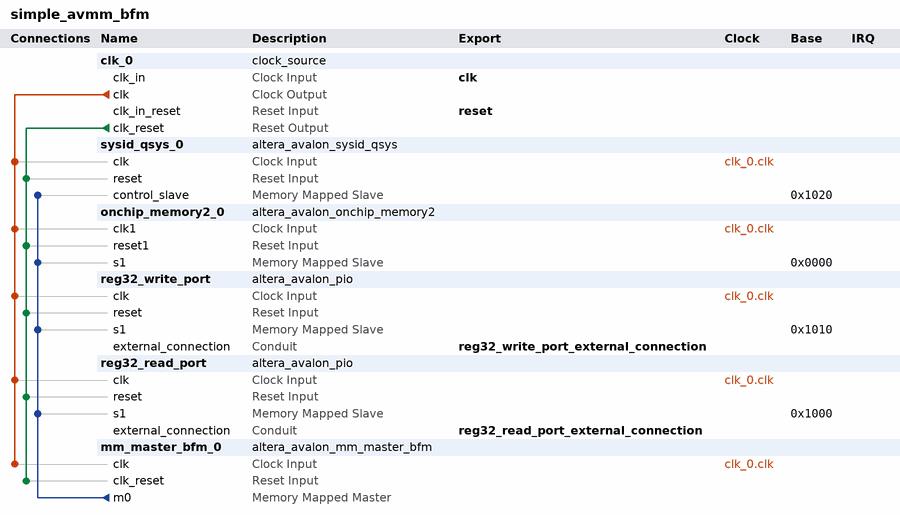
[diagram p0: system contents]
# Platform Designer (Qsys) system simple_avmm_bfm, MAX 10 10M02DCV36I7G
# Parameters at their usual value, and those the tool derives, are not listed.
package require -exact qsys 16.1
create_system simple_avmm_bfm
set_project_property DEVICE_FAMILY {MAX 10}
set_project_property DEVICE 10M02DCV36I7G

add_instance clk_0 clock_source 16.1
set_instance_parameter_value clk_0 clockFrequency 50000000

add_instance sysid_qsys_0 altera_avalon_sysid_qsys 16.1
set_instance_parameter_value sysid_qsys_0 id 538510345

add_instance onchip_memory2_0 altera_avalon_onchip_memory2 16.1
set_instance_parameter_value onchip_memory2_0 dataWidth 32
set_instance_parameter_value onchip_memory2_0 dualPort false
set_instance_parameter_value onchip_memory2_0 initMemContent true
set_instance_parameter_value onchip_memory2_0 initializationFileName onchip_mem.hex
set_instance_parameter_value onchip_memory2_0 memorySize 4096

add_instance reg32_write_port altera_avalon_pio 16.1
set_instance_parameter_value reg32_write_port direction Output
set_instance_parameter_value reg32_write_port width 32

add_instance reg32_read_port altera_avalon_pio 16.1
set_instance_parameter_value reg32_read_port direction Input
set_instance_parameter_value reg32_read_port width 32

add_instance mm_master_bfm_0 altera_avalon_mm_master_bfm 16.1
set_instance_parameter_value mm_master_bfm_0 ADDRESS_UNITS SYMBOLS
set_instance_parameter_value mm_master_bfm_0 AV_ADDRESS_W 32
set_instance_parameter_value mm_master_bfm_0 AV_ALWAYS_BURST_MAX_BURST 0
set_instance_parameter_value mm_master_bfm_0 AV_BURSTCOUNT_W 3
set_instance_parameter_value mm_master_bfm_0 AV_BURST_BNDR_ONLY 1
set_instance_parameter_value mm_master_bfm_0 AV_BURST_LINEWRAP 1
set_instance_parameter_value mm_master_bfm_0 AV_CONSTANT_BURST_BEHAVIOR 1
set_instance_parameter_value mm_master_bfm_0 AV_FIX_READ_LATENCY 1
set_instance_parameter_value mm_master_bfm_0 AV_MAX_PENDING_WRITES 0
set_instance_parameter_value mm_master_bfm_0 AV_NUMSYMBOLS 4
set_instance_parameter_value mm_master_bfm_0 AV_READRESPONSE_W 8
set_instance_parameter_value mm_master_bfm_0 AV_READ_WAIT_TIME 1
set_instance_parameter_value mm_master_bfm_0 AV_WRITERESPONSE_W 8
set_instance_parameter_value mm_master_bfm_0 USE_BURSTCOUNT 1
set_instance_parameter_value mm_master_bfm_0 USE_BYTE_ENABLE 1
set_instance_parameter_value mm_master_bfm_0 USE_READ 1
set_instance_parameter_value mm_master_bfm_0 USE_READ_DATA 1
set_instance_parameter_value mm_master_bfm_0 USE_READ_DATA_VALID 1
set_instance_parameter_value mm_master_bfm_0 USE_WAIT_REQUEST 1
set_instance_parameter_value mm_master_bfm_0 VHDL_ID 0

# connections
add_connection clk_0.clk mm_master_bfm_0.clk clock
add_connection clk_0.clk onchip_memory2_0.clk1 clock
add_connection clk_0.clk reg32_read_port.clk clock
add_connection clk_0.clk reg32_write_port.clk clock
add_connection clk_0.clk sysid_qsys_0.clk clock
add_connection clk_0.clk_reset mm_master_bfm_0.clk_reset reset
add_connection clk_0.clk_reset onchip_memory2_0.reset1 reset
add_connection clk_0.clk_reset reg32_read_port.reset reset
add_connection clk_0.clk_reset reg32_write_port.reset reset
add_connection clk_0.clk_reset sysid_qsys_0.reset reset
add_connection mm_master_bfm_0.m0 onchip_memory2_0.s1 avalon
set_connection_parameter_value mm_master_bfm_0.m0/onchip_memory2_0.s1 baseAddress 0x0000
add_connection mm_master_bfm_0.m0 reg32_read_port.s1 avalon
set_connection_parameter_value mm_master_bfm_0.m0/reg32_read_port.s1 baseAddress 0x1000
add_connection mm_master_bfm_0.m0 reg32_write_port.s1 avalon
set_connection_parameter_value mm_master_bfm_0.m0/reg32_write_port.s1 baseAddress 0x1010
add_connection mm_master_bfm_0.m0 sysid_qsys_0.control_slave avalon
set_connection_parameter_value mm_master_bfm_0.m0/sysid_qsys_0.control_slave baseAddress 0x1020

# exported interfaces
add_interface clk clock sink
set_interface_property clk EXPORT_OF clk_0.clk_in
add_interface reg32_read_port_external_connection conduit end
set_interface_property reg32_read_port_external_connection EXPORT_OF reg32_read_port.external_connection
add_interface reg32_write_port_external_connection conduit end
set_interface_property reg32_write_port_external_connection EXPORT_OF reg32_write_port.external_connection
add_interface reset reset sink
set_interface_property reset EXPORT_OF clk_0.clk_in_reset

set_interconnect_requirement {$system} qsys_mm.clockCrossingAdapter HANDSHAKE
set_interconnect_requirement {$system} qsys_mm.enableEccProtection FALSE
set_interconnect_requirement {$system} qsys_mm.insertDefaultSlave FALSE
set_interconnect_requirement {$system} qsys_mm.maxAdditionalLatency 1

save_system simple_avmm_bfm.qsys
